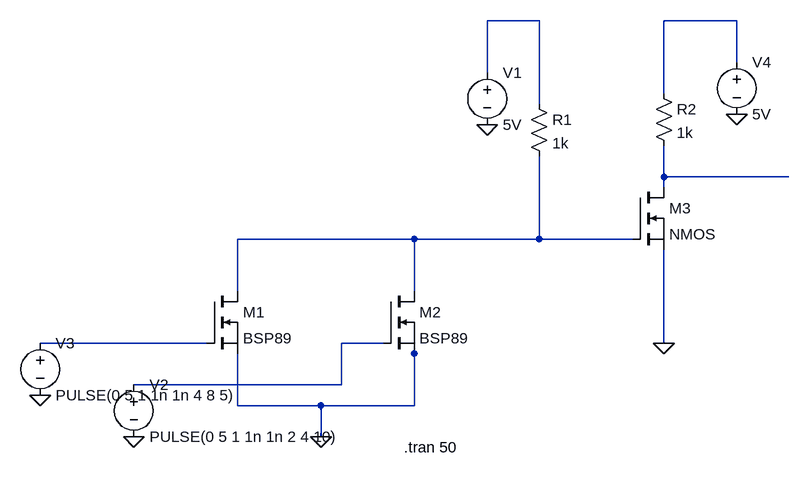
[diagram p0: schematic Nmos_OR.asc]
Nmos_OR.asc, the LTspice schematic file:
Version 4
SHEET 1 980 680
WIRE 592 -256 512 -256
WIRE 896 -256 784 -256
WIRE 896 -192 896 -256
WIRE 512 -176 512 -256
WIRE 784 -144 784 -256
WIRE 592 -128 592 -256
WIRE 784 -16 784 -64
WIRE 976 -16 784 -16
WIRE 784 0 784 -16
WIRE 400 80 128 80
WIRE 592 80 592 -48
WIRE 592 80 400 80
WIRE 736 80 592 80
WIRE 128 160 128 80
WIRE 400 160 400 80
WIRE 80 240 -176 240
WIRE 352 240 288 240
WIRE 784 240 784 96
WIRE 400 256 400 240
WIRE 288 304 288 240
WIRE 288 304 -32 304
WIRE 128 336 128 256
WIRE 256 336 128 336
WIRE 400 336 400 256
WIRE 400 336 256 336
WIRE 256 384 256 336
FLAG -32 384 0
FLAG -176 320 0
FLAG 256 384 0
FLAG 784 240 0
FLAG 896 -112 0
FLAG 512 -96 0
SYMBOL nmos 80 160 R0
SYMATTR InstName M1
SYMATTR Value BSP89
SYMBOL nmos 352 160 R0
SYMATTR InstName M2
SYMATTR Value BSP89
SYMBOL voltage -32 288 R0
WINDOW 123 0 0 Left 0
WINDOW 39 0 0 Left 0
SYMATTR InstName V2
SYMATTR Value PULSE(0 5 1 1n 1n 2 4 10)
SYMBOL voltage -176 224 R0
WINDOW 123 0 0 Left 0
WINDOW 39 0 0 Left 0
SYMATTR InstName V3
SYMATTR Value PULSE(0 5 1 1n 1n 4 8 5)
SYMBOL voltage 512 -192 R0
WINDOW 123 0 0 Left 0
WINDOW 39 0 0 Left 0
SYMATTR InstName V1
SYMATTR Value 5V
SYMBOL res 576 -144 R0
SYMATTR InstName R1
SYMATTR Value 1k
SYMBOL nmos 736 0 R0
SYMATTR InstName M3
SYMBOL voltage 896 -208 R0
WINDOW 123 0 0 Left 0
WINDOW 39 0 0 Left 0
SYMATTR InstName V4
SYMATTR Value 5V
SYMBOL res 768 -160 R0
SYMATTR InstName R2
SYMATTR Value 1k
TEXT 384 400 Left 2 !.tran 50

The netlist it stands for:
* Nmos_OR.asc
M1 N004 N005 0 0 BSP89
M2 N004 N006 0 0 BSP89
V2 N006 0 PULSE(0 5 1 1n 1n 2 4 10)
V3 N005 0 PULSE(0 5 1 1n 1n 4 8 5)
V1 N001 0 5V
R1 N001 N004 1k
M3 N003 N004 0 0 NMOS
V4 N002 0 5V
R2 N002 N003 1k
.model NMOS NMOS
.model PMOS PMOS
.lib standard.mos
.tran 50
.backanno
.end